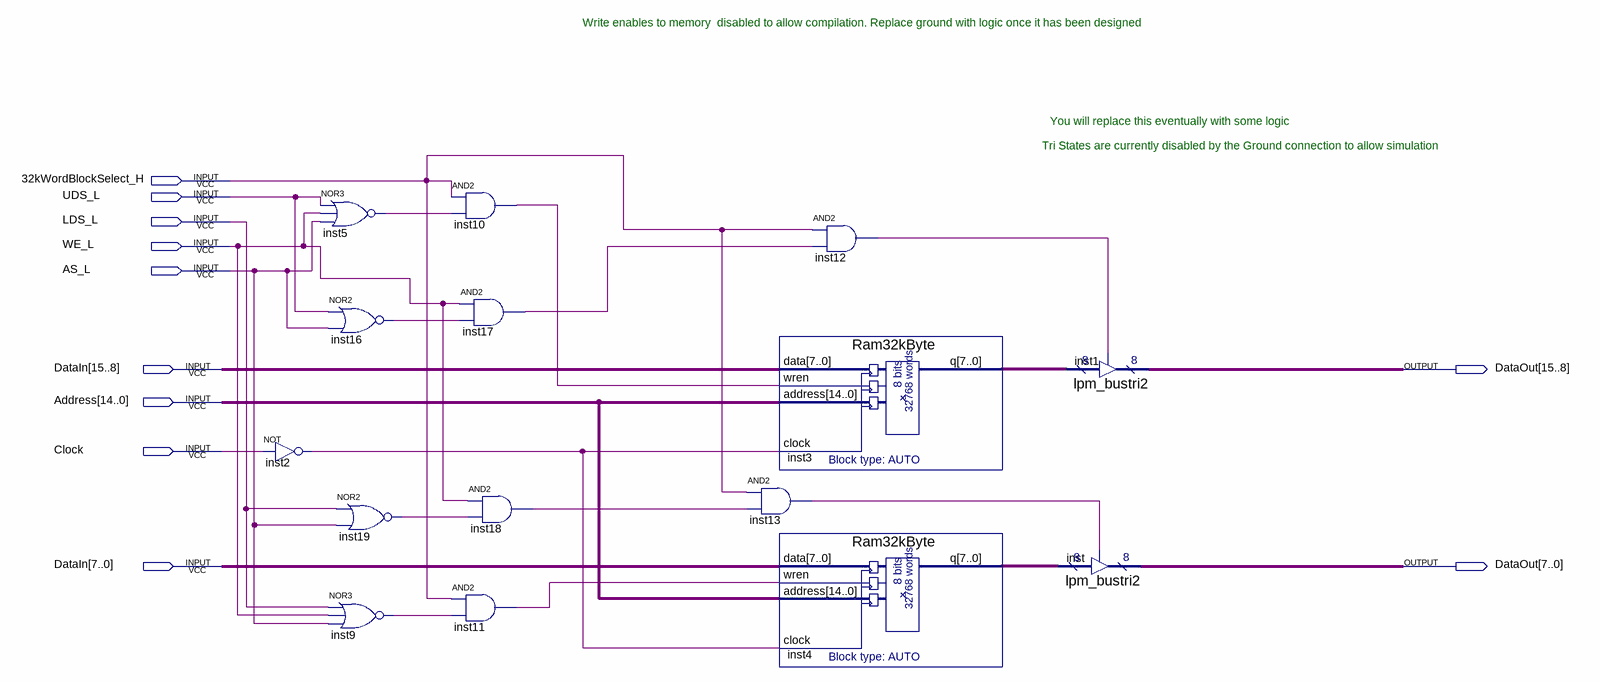
[diagram p0: schematic sheet]
// Quartus schematic SramBlock_32KWord.bdf as structural Verilog: 15 symbols, 11 pins
module SramBlock_32KWord (
  input  \32kWordBlockSelect_H ,
  input  UDS_L,
  input  LDS_L,
  input  WE_L,
  input  AS_L,
  input  [15:0] DataIn,
  input  [14:0] Address,
  input  Clock,
  output [15:0] DataOut
);

  wire inst2_out, inst5_out, inst9_out, inst10_out, inst11_out, inst12_out, inst13_out, inst16_out,
       inst17_out, inst18_out, inst19_out;
  wire [7:0] inst3_q, inst4_q;

  not inst2 (inst2_out, Clock);
  nor inst5 (inst5_out, UDS_L, WE_L, AS_L);
  nor inst16 (inst16_out, UDS_L, AS_L);
  nor inst19 (inst19_out, LDS_L, AS_L);
  nor inst9 (inst9_out, LDS_L, WE_L, AS_L);
  and inst10 (inst10_out, \32kWordBlockSelect_H , inst5_out);
  and inst17 (inst17_out, WE_L, inst16_out);
  and inst18 (inst18_out, WE_L, inst19_out);
  and inst11 (inst11_out, \32kWordBlockSelect_H , inst9_out);
  Ram32kByte inst3 (.data(DataIn[15:8]), .wren(inst10_out), .address(Address), .clock(inst2_out), .q(inst3_q));
  and inst13 (inst13_out, \32kWordBlockSelect_H , inst18_out);
  Ram32kByte inst4 (.data(DataIn[7:0]), .wren(inst11_out), .address(Address), .clock(inst2_out), .q(inst4_q));
  and inst12 (inst12_out, \32kWordBlockSelect_H , inst17_out);
  lpm_bustri2 inst1 (.enabledt(inst12_out), .data(inst3_q), .tridata(DataOut[15:8]));
  lpm_bustri2 inst (.enabledt(inst13_out), .data(inst4_q), .tridata(DataOut[7:0]));

  // Notes on the sheet:
  //   Write enables to memory  disabled to allow compilation. Replace ground with logic once it has been designed
  //   You will replace this eventually with some logic
  //   Tri States are currently disabled by the Ground connection to allow simulation
endmodule
